# Altium schematic sheet B503CA.SchDoc: Rain Sensor (Sense Plate)
size A4; SheetNumber: 1; SheetTotal: 1
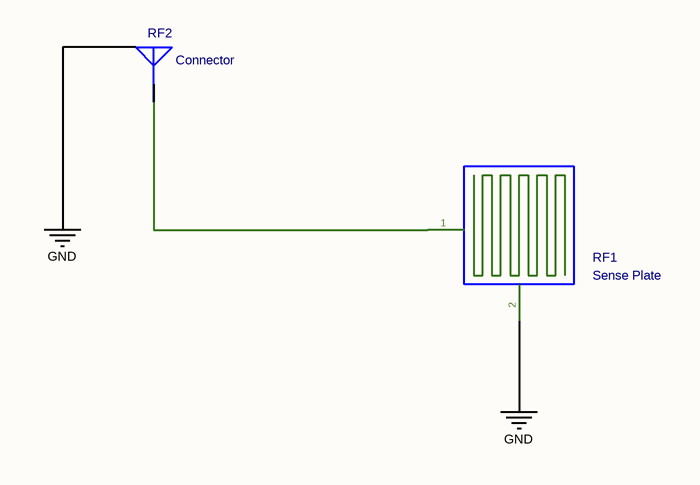
[diagram p0: B503CA.SchDoc]

## Parts
RF1  Sense Plate  [Capacitve_Sense_Plate]
RF2  Connector  [Connector_IPEX]

## Nets
GND: RF1.2(GND) RF2.2(GND)
NetRF1_1: RF1.1(SIGNAL) RF2.1(Signal)

## Notes on the sheet
- Title
- Size:
- Date:
- A4
- Number:
- Time:
- Revision:
- Sheet
- of
- File:

## Library data of the parts
RF1 = PCB - Capacitive Sense Plate: ROHS: Yes; Supplier 1: Arrow; Supplier 2: Digi-Key; Supplier 3: Digi-Key; Supplier 4: Digi-Key; Supplier Part Number 1: U.FL-R-SMT-1(10); Supplier Part Number 2: H11891TR-ND; Supplier Part Number 3: H11891CT-ND; Supplier Part Number 4: H11891DKR-ND
RF2 = Connector - MHF: Analog Signal MHF4 Connector; ROHS: Yes; Supplier 1: Mouser; Supplier 2: Arrow; Supplier Part Number 1: 200-RSP-122811-01; Supplier Part Number 2: RSP-122811-01; System: Connector